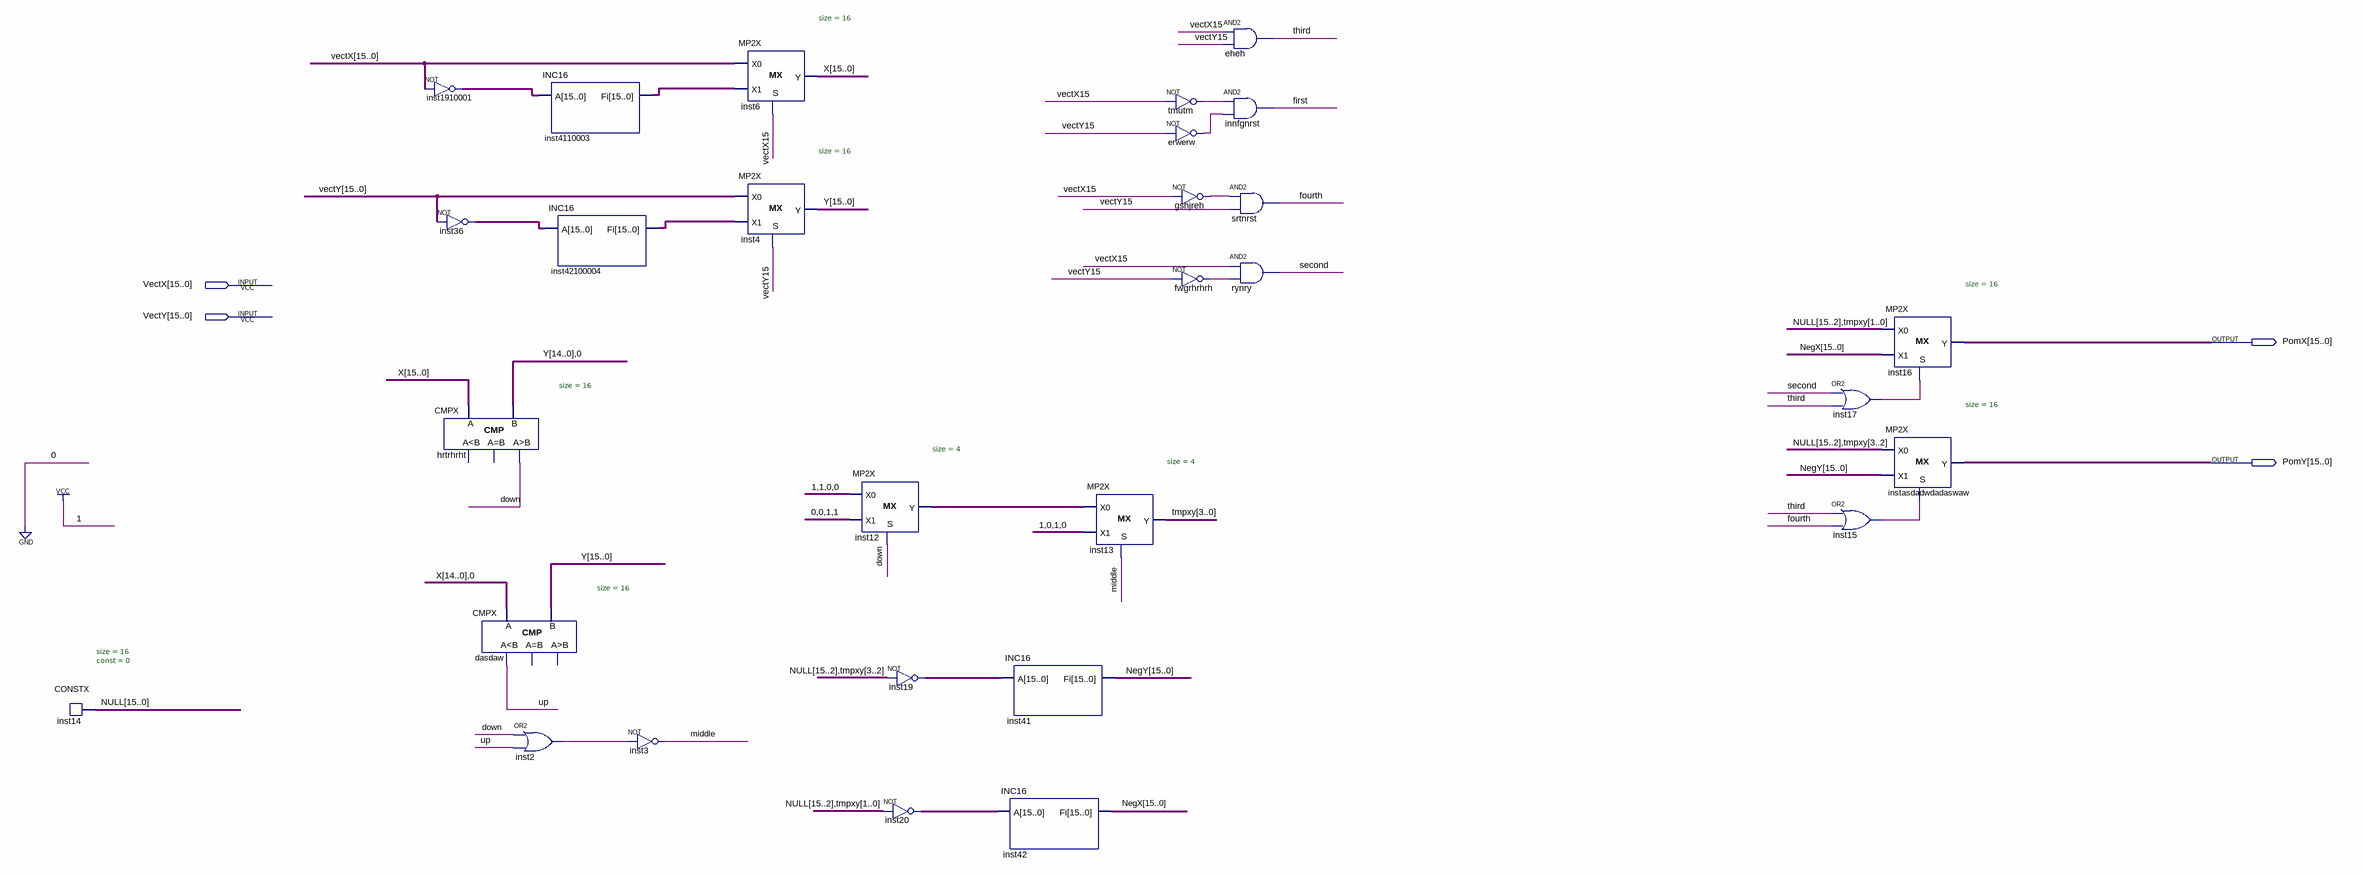
[diagram p0: schematic sheet]
// Quartus schematic VectorTransform.bdf as structural Verilog: 29 symbols, 4 pins
module VectorTransform (
  input  [15:0] VectX,
  input  [15:0] VectY,
  output [15:0] PomX,
  output [15:0] PomY
);

  wire down, erwerw_out, first, fourth, fwgrhrhrh_out, gshjreh_out, inst2_out, inst15_out, inst17_out,
       middle, second, third, tmutm_out, up;
  wire [3:0] inst12_y, tmpxy;
  wire [15:0] inst19_out, inst20_out, inst36_out, inst1910001_out, inst4110003_fi, inst42100004_fi, NegX,
       NegY, NULL, X, Y;

  CONSTX #(.size(16), .\const (0)) inst14 (.data(NULL));
  assign inst1910001_out = ~VectX;  // NOT inst1910001, 16 bits wide
  assign inst36_out = ~VectY;  // NOT inst36, 16 bits wide
  CMPX #(.size(16)) hrtrhrht (.A(X), .B({Y[14:0], 1'b0}), .gr(down));  // open: ls, eq
  CMPX #(.size(16)) dasdaw (.A({X[14:0], 1'b0}), .B(Y), .ls(up));  // open: eq, gr
  INC16 inst4110003 (.A(inst1910001_out), .Fi(inst4110003_fi));
  INC16 inst42100004 (.A(inst36_out), .Fi(inst42100004_fi));
  or inst2 (inst2_out, down, up);
  not inst3 (middle, inst2_out);
  MP2X #(.size(16)) inst6 (.S(VectX[15]), .X0(VectX), .X1(inst4110003_fi), .Y(X));
  MP2X #(.size(16)) inst4 (.S(VectY[15]), .X0(VectY), .X1(inst42100004_fi), .Y(Y));
  MP2X #(.size(4)) inst12 (.S(down), .X0(4'b1100), .X1(4'b0011), .Y(inst12_y));
  assign inst19_out = ~{NULL[15:2], tmpxy[3:2]};  // NOT inst19, 16 bits wide
  assign inst20_out = ~{NULL[15:2], tmpxy[1:0]};  // NOT inst20, 16 bits wide
  INC16 inst41 (.A(inst19_out), .Fi(NegY));
  INC16 inst42 (.A(inst20_out), .Fi(NegX));
  MP2X #(.size(4)) inst13 (.S(middle), .X0(inst12_y), .X1(4'b1010), .Y(tmpxy));
  not tmutm (tmutm_out, VectX[15]);
  not erwerw (erwerw_out, VectY[15]);
  not gshjreh (gshjreh_out, VectX[15]);
  not fwgrhrhrh (fwgrhrhrh_out, VectY[15]);
  and eheh (third, VectX[15], VectY[15]);
  and innfgnrst (first, tmutm_out, erwerw_out);
  and srtnrst (fourth, gshjreh_out, VectY[15]);
  and rynry (second, VectX[15], fwgrhrhrh_out);
  or inst17 (inst17_out, second, third);
  or inst15 (inst15_out, third, fourth);
  MP2X #(.size(16)) inst16 (.S(inst17_out), .X0({NULL[15:2], tmpxy[1:0]}), .X1(NegX), .Y(PomX));
  MP2X #(.size(16)) instasdadwdadaswaw (.S(inst15_out), .X0({NULL[15:2], tmpxy[3:2]}), .X1(NegY), .Y(PomY));
endmodule
